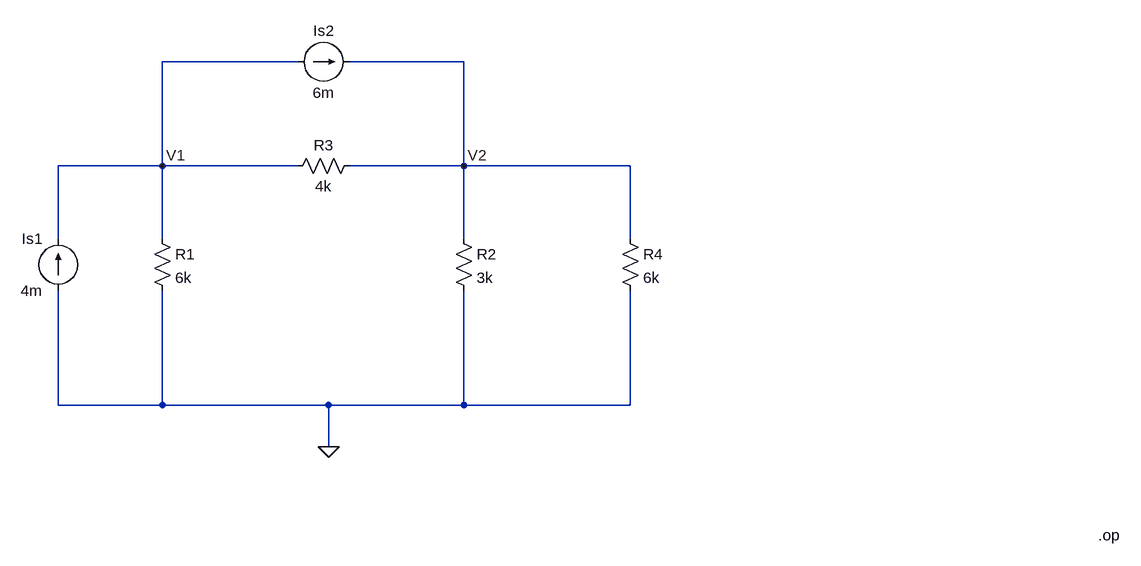
[diagram p0: schematic HW02-01.asc]
HW02-01.asc, the LTspice schematic file:
Version 4
SHEET 1 1768 680
WIRE 496 -160 288 -160
WIRE 752 -160 576 -160
WIRE 288 0 288 -160
WIRE 288 0 128 0
WIRE 496 0 288 0
WIRE 752 0 752 -160
WIRE 752 0 576 0
WIRE 1008 0 752 0
WIRE 128 112 128 0
WIRE 288 112 288 0
WIRE 752 112 752 0
WIRE 1008 112 1008 0
WIRE 128 368 128 192
WIRE 288 368 288 192
WIRE 288 368 128 368
WIRE 544 368 288 368
WIRE 752 368 752 192
WIRE 752 368 544 368
WIRE 1008 368 1008 192
WIRE 1008 368 752 368
WIRE 544 432 544 368
FLAG 544 432 0
FLAG 288 0 V1
FLAG 752 0 V2
SYMBOL current 128 192 R180
WINDOW 0 24 80 Left 2
WINDOW 3 24 0 Left 2
SYMATTR InstName Is1
SYMATTR Value 4m
SYMBOL res 272 96 R0
SYMATTR InstName R1
SYMATTR Value 6k
SYMBOL res 592 -16 R90
WINDOW 0 0 56 VBottom 2
WINDOW 3 32 56 VTop 2
SYMATTR InstName R3
SYMATTR Value 4k
SYMBOL res 736 96 R0
SYMATTR InstName R2
SYMATTR Value 3k
SYMBOL res 992 96 R0
SYMATTR InstName R4
SYMATTR Value 6k
SYMBOL current 496 -160 R270
WINDOW 0 32 40 VTop 2
WINDOW 3 -32 40 VBottom 2
SYMATTR InstName Is2
SYMATTR Value 6m
TEXT 1728 568 Left 2 !.op

The netlist it stands for:
* HW02-01.asc
Is1 0 V1 4m
R1 V1 0 6k
R3 V2 V1 4k
R2 V2 0 3k
R4 V2 0 6k
Is2 V1 V2 6m
.op
.backanno
.end